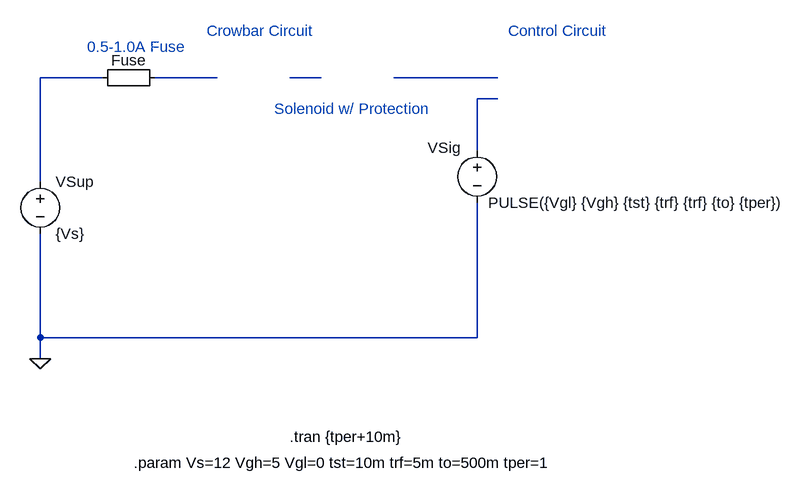
[diagram p0: schematic GenericSolenoidSimulation.asc]
GenericSolenoidSimulation.asc, the LTspice schematic file:
Version 4
SHEET 1 1112 952
WIRE -512 -416 -608 -416
WIRE -336 -416 -432 -416
WIRE -176 -416 -224 -416
WIRE 96 -416 -64 -416
WIRE 96 -384 64 -384
WIRE 64 -304 64 -384
WIRE -608 -256 -608 -416
WIRE -608 -16 -608 -176
WIRE 64 -16 64 -224
WIRE 64 -16 -608 -16
WIRE -608 16 -608 -16
FLAG -608 16 0
SYMBOL voltage -608 -272 R0
WINDOW 123 0 0 Left 2
WINDOW 39 24 44 Left 2
SYMATTR InstName VSup
SYMATTR Value {Vs}
SYMBOL voltage 64 -320 R0
WINDOW 3 17 96 Left 2
WINDOW 123 0 0 Left 2
WINDOW 39 0 0 Left 2
WINDOW 0 -76 12 Left 2
SYMATTR Value PULSE({Vgl} {Vgh} {tst} {trf} {trf} {to} {tper})
SYMATTR InstName VSig
SYMBOL Misc\\EuropeanResistor -528 -400 R270
WINDOW 0 27 56 VTop 2
WINDOW 3 28 58 Invisible 2
SYMATTR InstName Fuse
SYMATTR Value 0.000001
TEXT -224 136 Left 2 !.tran {tper+10m}
TEXT -464 176 Left 2 !.param Vs=12 Vgh=5 Vgl=0 tst=10m trf=5m to=500m tper=1
TEXT -536 -464 Left 2 ;0.5-1.0A Fuse
TEXT -352 -488 Left 2 ;Crowbar Circuit
TEXT -248 -368 Left 2 ;Solenoid w/ Protection
TEXT 112 -488 Left 2 ;Control Circuit

The netlist it stands for:
* GenericSolenoidSimulation.asc
VSup N001 0 {Vs}
VSig N005 0 PULSE({Vgl} {Vgh} {tst} {trf} {trf} {to} {tper})
R§Fuse N001 N002 0.000001
.tran {tper+10m}
.param Vs=12 Vgh=5 Vgl=0 tst=10m trf=5m to=500m tper=1
* 0.5-1.0A Fuse
* Crowbar Circuit
* Solenoid w/ Protection
* Control Circuit
.backanno
.end